# EAGLE design Big T Split - ROM Board (EAGLE 9.6.1)
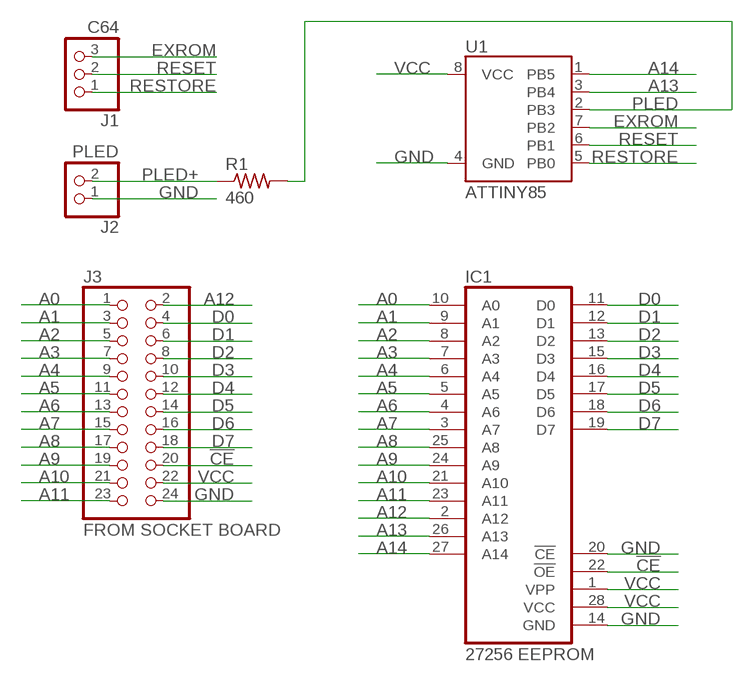
[diagram p0: schematic, sheet 1]

## Parts
IC1  27256 EEPROM  27256  [DIL28]
J1  C64  PINHD-1X3  [1X03]
J2  PLED  PINHD-1X2  [1X02]
J3  FROM SOCKET BOARD  PINHD-2X12  [2X12]
R1  460  R-US_R0805  [R0805]
U1  ATTINY85  [ATTINY85]

## Nets
!CE: IC1.22(!OE) J3.20
A0: IC1.10(A0) J3.1
A1: IC1.9(A1) J3.3
A2: IC1.8(A2) J3.5
A3: IC1.7(A3) J3.7
A4: IC1.6(A4) J3.9
A5: IC1.5(A5) J3.11
A6: IC1.4(A6) J3.13
A7: IC1.3(A7) J3.15
A8: IC1.25(A8) J3.17
A9: IC1.24(A9) J3.19
A10: IC1.21(A10) J3.21
A11: IC1.23(A11) J3.23
A12: IC1.2(A12) J3.2
A13: IC1.26(A13) U1.3(PB4)
A14: IC1.27(A14) U1.1(PB5)
D0: IC1.11(D0) J3.4
D1: IC1.12(D1) J3.6
D2: IC1.13(D2) J3.8
D3: IC1.15(D3) J3.10
D4: IC1.16(D4) J3.12
D5: IC1.17(D5) J3.14
D6: IC1.18(D6) J3.16
D7: IC1.19(D7) J3.18
EXROM: J1.3 U1.7(PB2)
GND: IC1.14(GND) IC1.20(!CE) J2.1 J3.24 U1.4(GND)
PLED: R1.2 U1.2(PB3)
PLED+: J2.2 R1.1
RESET: J1.2 U1.6(PB1)
RESTORE: J1.1 U1.5(PB0)
VCC: IC1.1(VPP) IC1.28(VCC) J3.22 U1.8(VCC)

## Library data of the parts
IC1 = myparts:27256: MEMORY
J1 = pinhead:PINHD-1X3: PIN HEADER
J2 = pinhead:PINHD-1X2: PIN HEADER
J3 = pinhead:PINHD-2X12: PIN HEADER
R1 = rcl:R-US_: RESISTOR, American symbol; SPICEPREFIX: R
U1 = SparkFun-IC-Microcontroller:ATTINY85; PROD_ID: IC-09092

## Board
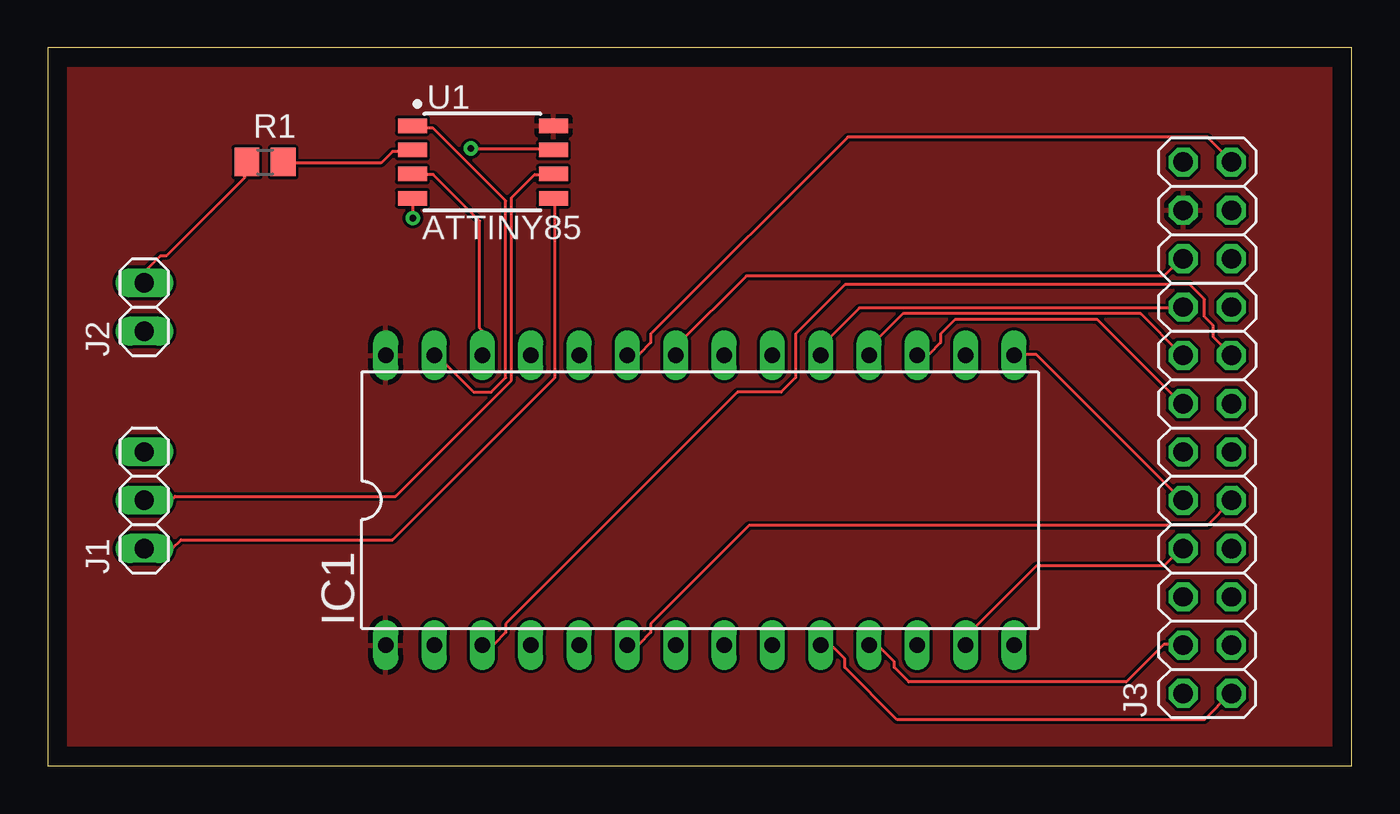
[diagram p1: board, top side]
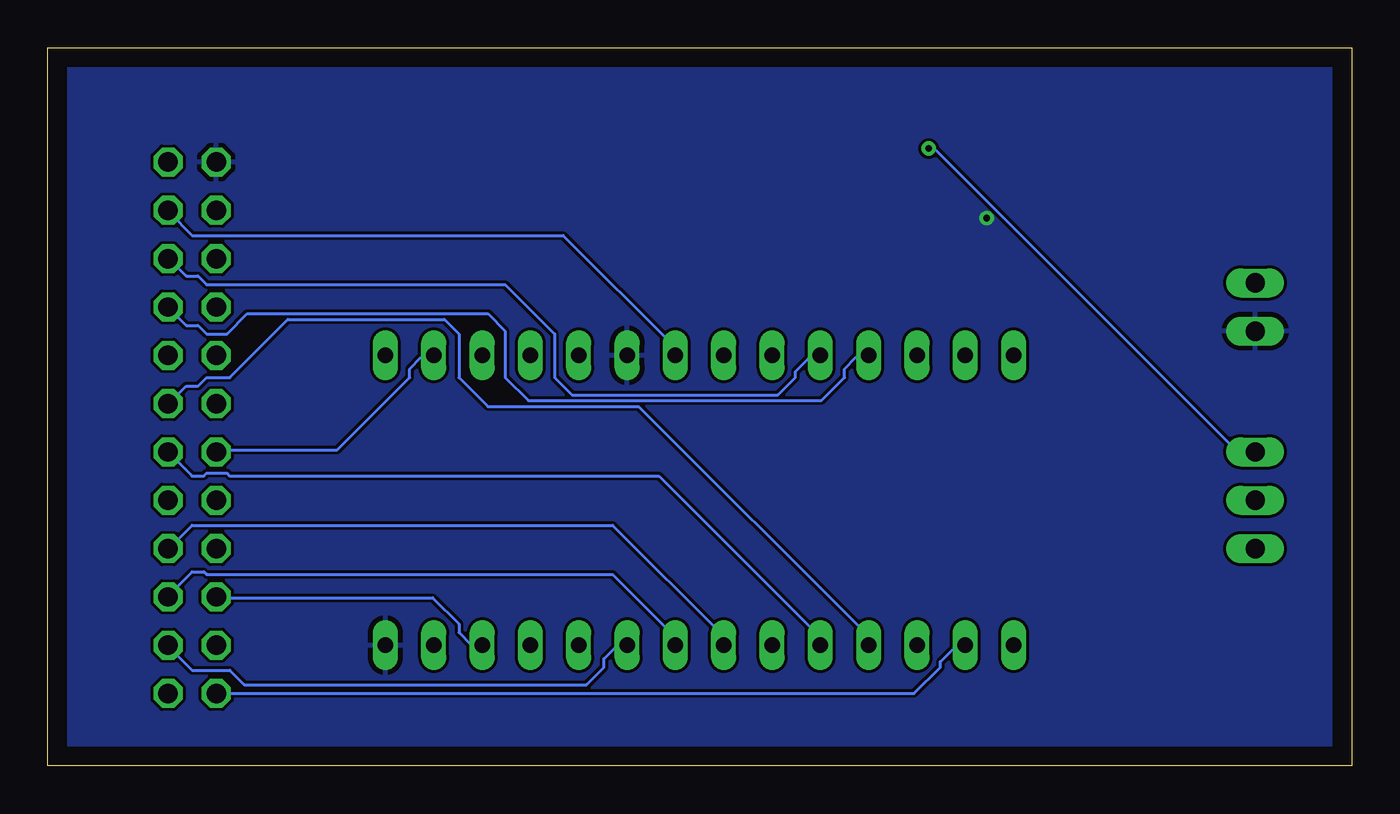
[diagram p2: board, bottom side, seen from below]

Size 68.56 x 37.77 mm. Coordinates in mm from the lower left corner, seen from the top.
Outline: 0,0 68.56,0 68.56,37.77 0,37.77 0,0
Copper layers (1*16): Top 0.035mm / dielectric 1.5mm / Bottom 0.035mm
Design rules "default": minimum track width 6mil, minimum drill 0.35mm, track to track 6mil, track to pad 6mil, pad to pad 6mil, via to via 6mil, smd to smd 6mil, copper to edge 40mil, drill to drill 6mil, minimum pad ring 10mil, minimum via ring 8mil, stop-mask expansion 4mil, vias tented up to drill 0mil, thermal gap 10mil

### Footprints (pad centres in the part's own frame; a part is rotated, then mirrored left to right if it is on the bottom)
DIL28 = drill 0.813 long: 1 -16.51,-7.62; 2 -13.97,-7.62; 3 -11.43,-7.62; 4 -8.89,-7.62; 5 -6.35,-7.62; 6 -3.81,-7.62; 7 -1.27,-7.62; 8 1.27,-7.62; 9 3.81,-7.62; 10 6.35,-7.62; 11 8.89,-7.62; 12 11.43,-7.62; 13 13.97,-7.62; 14 16.51,-7.62; 15 16.51,7.62; 16 13.97,7.62; 17 11.43,7.62; 18 8.89,7.62; 19 6.35,7.62; 20 3.81,7.62; 21 1.27,7.62; 22 -1.27,7.62; 23 -3.81,7.62; 24 -6.35,7.62; 25 -8.89,7.62; 26 -11.43,7.62; 27 -13.97,7.62; 28 -16.51,7.62
1X03 = drill 1.016 long: 1 -2.54,0; 2 0,0; 3 2.54,0
1X02 = drill 1.016 long: 1 -1.27,0; 2 1.27,0
2X12 = drill 1.016 octagon: 1 -13.97,-1.27; 2 -13.97,1.27; 3 -11.43,-1.27; 4 -11.43,1.27; 5 -8.89,-1.27; 6 -8.89,1.27; 7 -6.35,-1.27; 8 -6.35,1.27; 9 -3.81,-1.27; 10 -3.81,1.27; 11 -1.27,-1.27; 12 -1.27,1.27; 13 1.27,-1.27; 14 1.27,1.27; 15 3.81,-1.27; 16 3.81,1.27; 17 6.35,-1.27; 18 6.35,1.27; 19 8.89,-1.27; 20 8.89,1.27; 21 11.43,-1.27; 22 11.43,1.27; 23 13.97,-1.27; 24 13.97,1.27
R0805 = smd 1.3 x 1.5: 1 -0.95,0; 2 0.95,0
ATTINY85 = smd 1.524 x 0.762: 1 -3.683,1.905; 2 -3.683,0.635; 3 -3.683,-0.635; 4 -3.683,-1.905; 5 3.727,-1.905; 6 3.727,-0.635; 7 3.727,0.635; 8 3.727,1.905

### Placement (x,y rotation side)
IC1  34.29,13.97 0 top
J1  5.08,13.97 90 top
J2  5.08,24.13 90 top
J3  60.96,17.78 90 top
R1  11.43,31.75 0 top
U1  22.86,31.75 0 top

### Tracks (layer width: path | path; a pad name or v marks a point on that pad's centre or on a via)
!CE
  Top 0.152: IC1.22 33.07,21.64 33.07,22.1 36.73,25.76 58.67,25.76 59.59,26.67 J3.20
A0
  Top 0.152: IC1.10 40.69,6.25 41.3,6.25 41.91,5.64 41.91,5.18 44.65,2.44 60.81,2.44 62.18,3.81 J3.1
A1
  Bottom 0.152: IC1.9 38.1,6.25 38.71,6.25 39.32,5.64 39.32,5.18 40.23,4.27 58.22,4.27 58.98,5.03 60.96,5.03 62.18,6.25 J3.3
A2
  Bottom 0.152: IC1.8 35.66,6.4 35.66,6.86 38.86,10.06 60.2,10.06 60.35,10.21 60.96,10.21 62.18,8.99 J3.5
A3
  Bottom 0.152: IC1.7 33.07,6.4 33.07,6.86 38.86,12.65 60.96,12.65 62.18,11.43 J3.7
A4
  Top 0.152: IC1.6 30.48,6.4 31.09,6.4 31.7,7.01 31.7,7.47 36.88,12.65 60.96,12.65 62.18,13.87 J3.9
A5
  Bottom 0.152: J3.11 60.96,15.24 60.35,15.24 60.2,15.39 59.13,15.39 58.98,15.24 36.42,15.24 28.04,6.86 28.04,6.4 IC1.5
A6
  Bottom 0.152: IC1.4 25.45,6.4 25.45,6.86 37.49,18.9 45.41,18.9 46.94,20.42 46.94,22.71 47.7,23.47 55.93,23.47 58.98,20.42 60.2,20.42 60.66,19.96 61.27,19.96 62.18,19.05 J3.13
A7
  Top 0.152: J3.15 61.27,22.55 61.27,23.16 60.81,23.62 60.81,24.54 60.05,25.3 41.91,25.3 39.32,22.71 39.32,20.42 38.56,19.66 36.27,19.66 24.08,7.47 24.08,7.01 23.47,6.4 22.86,6.4 IC1.3
A8
  Bottom 0.152: J3.17 61.27,23.16 60.66,23.16 60.2,22.71 59.13,22.71 58.06,23.77 45.41,23.77 44.5,22.86 44.5,20.42 43.28,19.2 27.89,19.2 26.67,20.42 26.67,20.88 26.06,21.49 25.45,21.49 IC1.25
A9
  Bottom 0.152: IC1.24 28.04,21.49 28.5,21.49 29.26,20.73 29.26,20.42 30.18,19.51 41,19.51 41.91,20.42 41.91,22.71 44.5,25.3 60.2,25.3 60.66,25.76 61.27,25.76 62.18,26.67 J3.19
A10
  Bottom 0.152: IC1.21 35.66,21.64 35.66,22.1 41.45,27.89 60.96,27.89 62.18,29.11 J3.21
A11
  Top 0.152: IC1.23 30.48,21.64 31.09,21.64 31.7,22.25 31.7,22.71 42.06,33.07 60.96,33.07 62.18,31.85 J3.23
A12
  Bottom 0.152: J3.2 23.01,3.81 21.64,5.18 21.64,5.49 20.88,6.25 20.42,6.25 IC1.2
A13
  Top 0.152: IC1.26 22.86,22.86 22.71,23.01 22.71,28.65 20.27,31.09 19.2,31.09 U1.3
A14
  Top 0.152: U1.1 19.2,33.53 20.27,33.53 24.08,29.72 24.08,20.42 23.32,19.66 22.4,19.66 20.42,21.64 IC1.27
D0
  Top 0.152: IC1.11 43.28,6.25 43.74,6.25 44.5,5.49 44.5,5.18 45.26,4.42 56.69,4.42 58.67,6.4 59.59,6.4 J3.4
D1
  Bottom 0.152: IC1.12 45.72,6.4 46.33,6.4 46.94,7.01 46.94,7.47 48.31,8.84 59.59,8.84 J3.6
D2
  Top 0.152: IC1.13 48.31,6.4 48.31,6.86 51.97,10.52 58.67,10.52 59.59,11.43 J3.8
D3
  Top 0.152: IC1.15 50.9,21.64 51.97,21.64 59.59,14.02 J3.10
D4
  Bottom 0.152: IC1.16 48.31,21.49 48.92,21.49 49.53,20.88 49.53,20.42 53.34,16.61 59.59,16.61 J3.12
D5
  Top 0.152: IC1.17 45.72,21.64 46.33,21.64 46.94,22.25 46.94,22.71 47.7,23.47 55.17,23.47 59.59,19.05 J3.14
D6
  Top 0.152: IC1.18 43.28,21.64 43.28,22.1 44.96,23.77 57.45,23.77 59.59,21.64 J3.16
D7
  Top 0.152: IC1.19 40.69,21.64 40.69,22.1 42.67,24.08 59.59,24.08 J3.18
EXROM  (via drill 0.35)
  Top 0.152: v22.25,32.46 26.52,32.46 U1.7
  Bottom 0.152: v22.25,32.46 21.95,32.46 6.1,16.61 5.18,16.61 J1.3
GND  (via drill 0.35)
  Top 0.152: v19.2,28.8 19.2,29.72 U1.4
  pour Bottom: 0,0 68.58,0 68.58,38.1 0,38.1
PLED
  Top 0.152: R1.2 12.5,31.7 17.53,31.7 18.14,32.31 19.05,32.31 U1.2
PLED+
  Top 0.152: R1.1 10.36,31.7 10.36,30.94 6.25,26.82 5.94,26.82 5.18,26.06 5.18,25.45 J2.2
RESET
  Top 0.152: U1.6 26.52,31.09 25.6,31.09 24.38,29.87 24.38,20.27 18.29,14.17 6.71,14.17 6.55,14.02 5.18,14.02 J1.2
RESTORE
  Top 0.152: J1.1 6.55,11.43 7.01,11.89 18.14,11.89 26.67,20.42 26.67,29.72 U1.5
VCC
  pour Top: 0,0 68.58,0 68.58,36.83 68.58,38.1 0,38.1